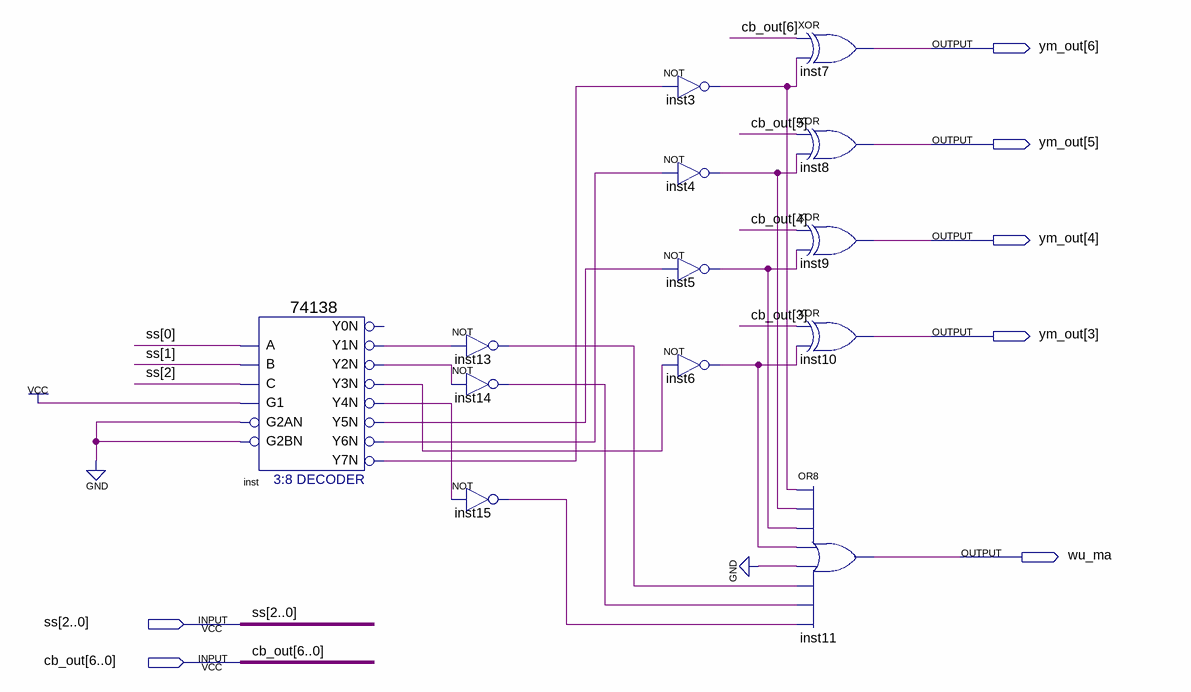
[diagram p0: schematic sheet]
// Quartus schematic yima.bdf as structural Verilog: 13 symbols, 7 pins
module yima (
  input  [2:0] ss,
  input  [6:0] cb_out,
  output [6:3] ym_out,
  output wu_ma
);

  wire inst3_out, inst4_out, inst5_out, inst6_out, inst13_out, inst14_out, inst15_out, inst_y1n, inst_y2n,
       inst_y3n, inst_y4n, inst_y5n, inst_y6n, inst_y7n;

  \74138  inst (
    .A(ss[0]), .B(ss[1]), .G1(1'b1), .C(ss[2]), .G2AN(1'b0), .G2BN(1'b0), .Y1N(inst_y1n), .Y2N(inst_y2n),
    .Y3N(inst_y3n), .Y4N(inst_y4n), .Y5N(inst_y5n), .Y6N(inst_y6n), .Y7N(inst_y7n));  // open: Y0N
  not inst13 (inst13_out, inst_y1n);
  not inst14 (inst14_out, inst_y2n);
  not inst15 (inst15_out, inst_y4n);
  not inst3 (inst3_out, inst_y7n);
  not inst4 (inst4_out, inst_y6n);
  not inst5 (inst5_out, inst_y5n);
  not inst6 (inst6_out, inst_y3n);
  xor inst7 (ym_out[6], cb_out[6], inst3_out);
  xor inst8 (ym_out[5], cb_out[5], inst4_out);
  xor inst9 (ym_out[4], cb_out[4], inst5_out);
  xor inst10 (ym_out[3], cb_out[3], inst6_out);
  or inst11 (wu_ma, inst3_out, inst4_out, inst5_out, inst6_out, 1'b0, inst13_out, inst14_out, inst15_out);
endmodule
